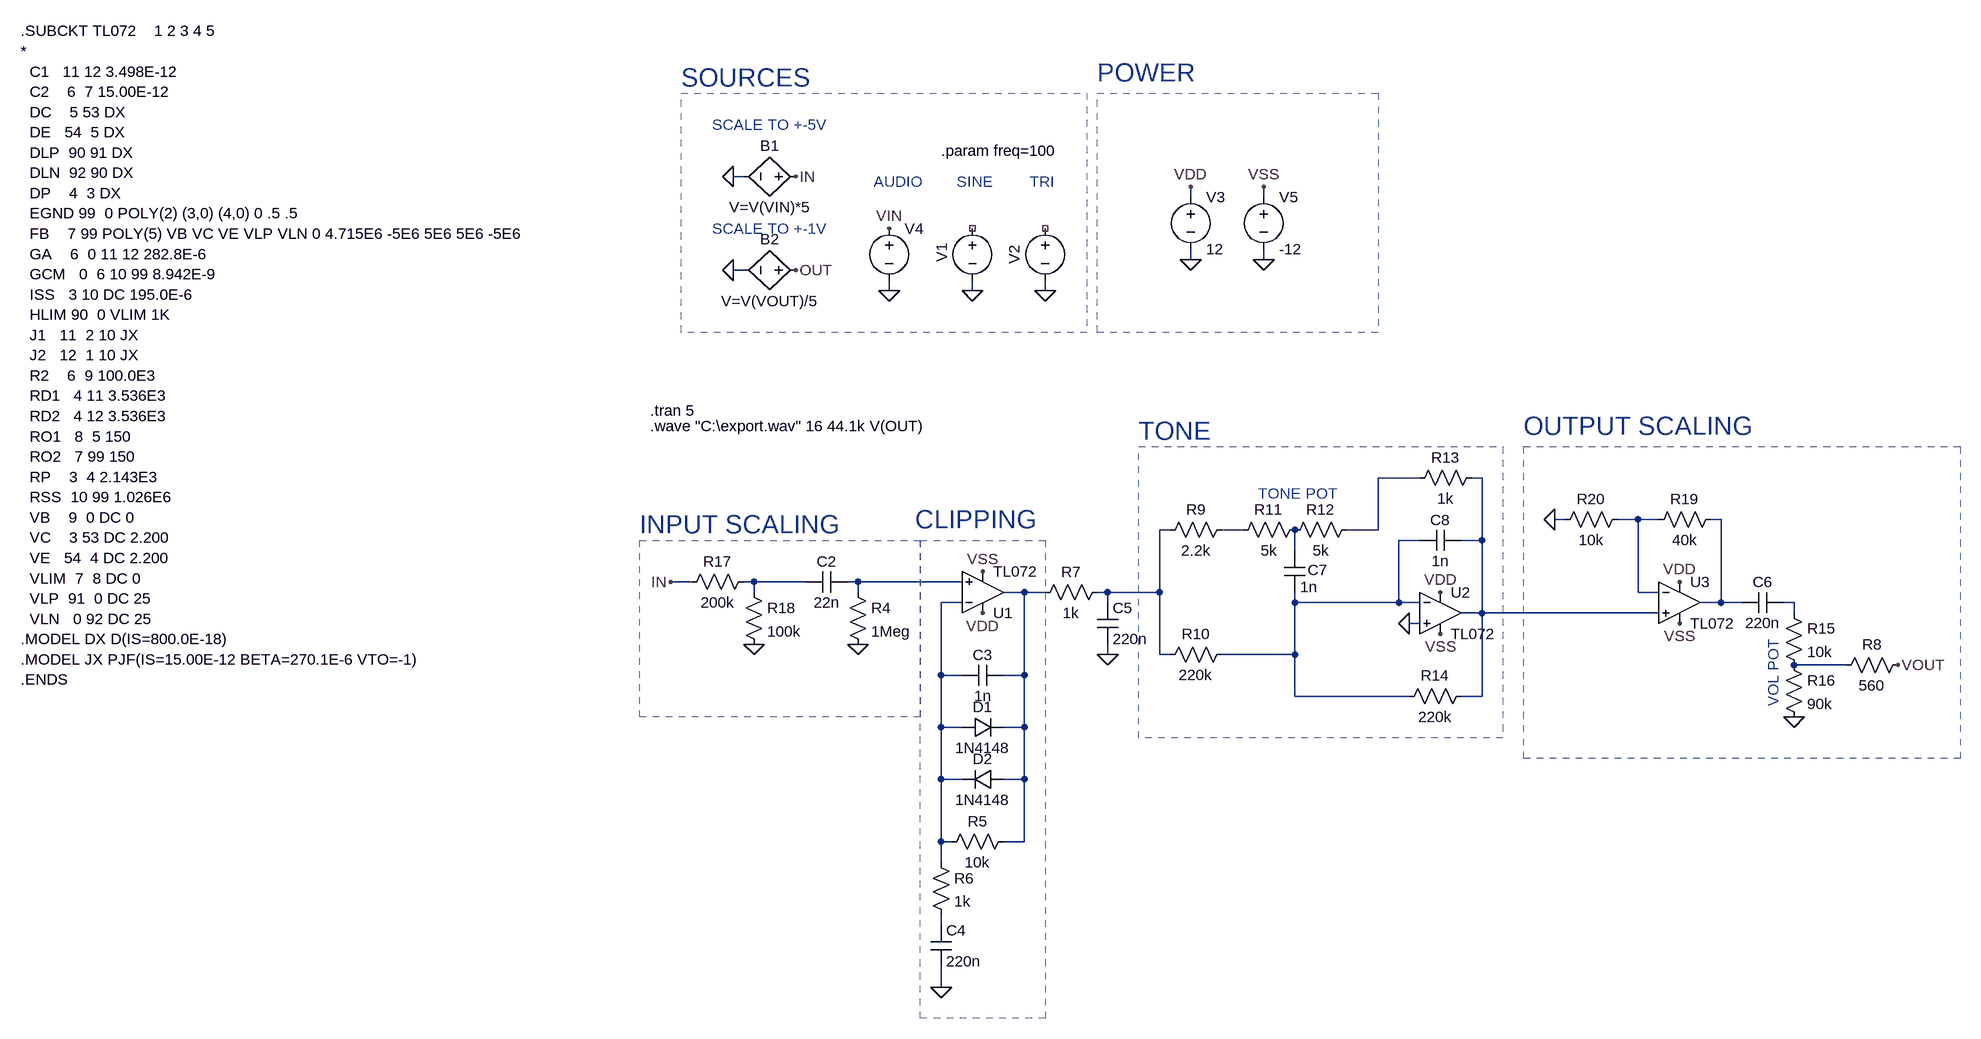
[diagram p0: schematic od.asc]
od.asc, the LTspice schematic file:
Version 4
SHEET 1 1620 1480
WIRE -576 32 -592 32
WIRE 112 64 112 48
WIRE 224 64 224 48
WIRE 112 160 112 144
WIRE 224 160 224 144
WIRE -576 176 -592 176
WIRE -352 208 -352 192
WIRE -224 208 -224 192
WIRE -112 208 -112 192
WIRE 464 496 400 496
WIRE 560 496 544 496
WIRE 688 560 672 560
WIRE 800 560 768 560
WIRE 832 560 800 560
WIRE 928 560 912 560
WIRE 80 576 64 576
WIRE 192 576 160 576
WIRE 400 576 400 496
WIRE 400 576 352 576
WIRE 464 592 432 592
WIRE 560 592 560 496
WIRE 560 592 528 592
WIRE 272 608 272 576
WIRE -656 656 -688 656
WIRE -560 656 -576 656
WIRE -480 656 -560 656
WIRE -400 656 -416 656
WIRE -240 656 -400 656
WIRE -560 672 -560 656
WIRE -400 672 -400 656
WIRE -144 672 -176 672
WIRE -112 672 -144 672
WIRE -16 672 -32 672
WIRE 64 672 64 576
WIRE 64 672 -16 672
WIRE 800 672 800 560
WIRE 832 672 800 672
WIRE -240 688 -272 688
WIRE -16 688 -16 672
WIRE 272 688 272 672
WIRE 432 688 432 592
WIRE 432 688 272 688
WIRE 464 688 432 688
WIRE 928 688 928 560
WIRE 928 688 896 688
WIRE 960 688 928 688
WIRE 1040 688 1024 688
WIRE 560 704 560 592
WIRE 560 704 528 704
WIRE 832 704 560 704
WIRE 1040 704 1040 688
WIRE 464 720 448 720
WIRE -16 768 -16 752
WIRE 64 768 64 672
WIRE 80 768 64 768
WIRE 272 768 272 688
WIRE 272 768 160 768
WIRE 1120 784 1040 784
WIRE -272 800 -272 688
WIRE -240 800 -272 800
WIRE -144 800 -144 672
WIRE -144 800 -176 800
WIRE 272 832 272 768
WIRE 448 832 272 832
WIRE 560 832 560 704
WIRE 560 832 528 832
WIRE -272 880 -272 800
WIRE -240 880 -272 880
WIRE -144 880 -144 800
WIRE -144 880 -176 880
WIRE -272 960 -272 880
WIRE -240 960 -272 960
WIRE -144 960 -144 880
WIRE -144 960 -176 960
WIRE -272 1056 -272 960
WIRE -256 1056 -272 1056
WIRE -144 1056 -144 960
WIRE -144 1056 -176 1056
WIRE -272 1088 -272 1056
WIRE -272 1184 -272 1168
WIRE -272 1280 -272 1248
FLAG -352 112 VIN
FLAG -688 656 IN
FLAG -208 640 VSS
FLAG -208 704 VDD
FLAG 496 736 VSS
FLAG 496 672 VDD
FLAG 1200 784 VOUT
FLAG -496 32 IN
FLAG 864 656 VDD
FLAG 864 720 VSS
FLAG -496 176 OUT
FLAG 112 160 0
FLAG 224 160 0
FLAG 112 48 VDD
FLAG 224 48 VSS
FLAG -352 208 0
FLAG -592 176 0
FLAG -592 32 0
FLAG -560 752 0
FLAG -400 752 0
FLAG 448 720 0
FLAG 672 560 0
FLAG 1040 864 0
FLAG -272 1280 0
FLAG -16 768 0
FLAG -224 208 0
FLAG -112 208 0
SYMBOL voltage -112 96 R0
WINDOW 0 -32 56 VBottom 2
WINDOW 3 32 56 Invisible 2
WINDOW 123 0 0 Left 0
WINDOW 39 0 0 Left 0
SYMATTR InstName V2
SYMATTR Value PULSE(0 250m 0 {0.5/freq} {0.5/freq} 0 {1/freq})
SYMBOL voltage -224 96 R0
WINDOW 0 -47 39 VRight 2
WINDOW 3 24 96 Invisible 2
WINDOW 123 0 0 Left 0
WINDOW 39 0 0 Left 0
SYMATTR InstName V1
SYMATTR Value SINE(0 1 {freq})
SYMBOL voltage -352 96 R0
WINDOW 3 24 96 Invisible 2
SYMATTR Value wavefile="C:\input.wav" chan=0
SYMATTR InstName V4
SYMBOL cap -416 640 R90
WINDOW 0 0 32 VBottom 2
WINDOW 3 32 32 VTop 2
SYMATTR InstName C2
SYMATTR Value 22n
SYMBOL res -416 656 R0
SYMATTR InstName R4
SYMATTR Value 1Meg
SYMBOL OpAmps\\opamp2 -208 736 M180
SYMATTR InstName U1
SYMATTR Value TL072
SYMBOL cap -176 784 R90
WINDOW 0 0 32 VBottom 2
WINDOW 3 32 32 VTop 2
SYMATTR InstName C3
SYMATTR Value 1n
SYMBOL diode -240 896 R270
WINDOW 0 32 32 VTop 2
WINDOW 3 0 32 VBottom 2
SYMATTR InstName D1
SYMATTR Value 1N4148
SYMBOL diode -176 944 R90
WINDOW 0 0 32 VBottom 2
WINDOW 3 32 32 VTop 2
SYMATTR InstName D2
SYMATTR Value 1N4148
SYMBOL res -160 1040 R90
WINDOW 0 0 56 VBottom 2
WINDOW 3 32 56 VTop 2
SYMATTR InstName R5
SYMATTR Value 10k
SYMBOL res -288 1072 R0
SYMATTR InstName R6
SYMATTR Value 1k
SYMBOL cap -288 1184 R0
SYMATTR InstName C4
SYMATTR Value 220n
SYMBOL res -16 656 R90
WINDOW 0 0 56 VBottom 2
WINDOW 3 32 56 VTop 2
SYMATTR InstName R7
SYMATTR Value 1k
SYMBOL cap -32 688 R0
SYMATTR InstName C5
SYMATTR Value 220n
SYMBOL cap 1024 672 R90
WINDOW 0 0 32 VBottom 2
WINDOW 3 32 32 VTop 2
SYMATTR InstName C6
SYMATTR Value 220n
SYMBOL res 176 560 R90
WINDOW 0 0 56 VBottom 2
WINDOW 3 32 56 VTop 2
SYMATTR InstName R9
SYMATTR Value 2.2k
SYMBOL res 176 752 R90
WINDOW 0 0 56 VBottom 2
WINDOW 3 32 56 VTop 2
SYMATTR InstName R10
SYMATTR Value 220k
SYMBOL res 288 560 R90
WINDOW 0 0 56 VBottom 2
WINDOW 3 32 56 VTop 2
SYMATTR InstName R11
SYMATTR Value 5k
SYMBOL res 368 560 R90
WINDOW 0 0 56 VBottom 2
WINDOW 3 32 56 VTop 2
SYMATTR InstName R12
SYMATTR Value 5k
SYMBOL cap 256 608 R0
WINDOW 0 36 30 Left 2
SYMATTR InstName C7
SYMATTR Value 1n
SYMBOL OpAmps\\opamp2 496 640 R0
SYMATTR InstName U2
SYMATTR Value TL072
SYMBOL cap 528 576 R90
WINDOW 0 0 32 VBottom 2
WINDOW 3 32 32 VTop 2
SYMATTR InstName C8
SYMATTR Value 1n
SYMBOL res 560 480 R90
WINDOW 0 0 56 VBottom 2
WINDOW 3 32 56 VTop 2
SYMATTR InstName R13
SYMATTR Value 1k
SYMBOL res 544 816 R90
WINDOW 0 0 56 VBottom 2
WINDOW 3 32 56 VTop 2
SYMATTR InstName R14
SYMATTR Value 220k
SYMBOL res 1024 688 R0
SYMATTR InstName R15
SYMATTR Value 10k
SYMBOL res 1024 768 R0
SYMATTR InstName R16
SYMATTR Value 90k
SYMBOL res 1216 768 R90
WINDOW 0 0 56 VBottom 2
WINDOW 3 32 56 VTop 2
SYMATTR InstName R8
SYMATTR Value 560
SYMBOL bv -480 32 R90
WINDOW 0 -32 56 VBottom 2
WINDOW 3 32 56 VTop 2
SYMATTR InstName B1
SYMATTR Value V=V(VIN)*5
SYMBOL res -560 640 R90
WINDOW 0 0 56 VBottom 2
WINDOW 3 32 56 VTop 2
SYMATTR InstName R17
SYMATTR Value 200k
SYMBOL res -576 656 R0
SYMATTR InstName R18
SYMATTR Value 100k
SYMBOL OpAmps\\opamp2 864 624 R0
SYMATTR InstName U3
SYMATTR Value TL072
SYMBOL res 928 544 R90
WINDOW 0 0 56 VBottom 2
WINDOW 3 32 56 VTop 2
SYMATTR InstName R19
SYMATTR Value 40k
SYMBOL res 784 544 R90
WINDOW 0 0 56 VBottom 2
WINDOW 3 32 56 VTop 2
SYMATTR InstName R20
SYMATTR Value 10k
SYMBOL bv -480 176 R90
WINDOW 0 -32 56 VBottom 2
WINDOW 3 32 56 VTop 2
SYMATTR InstName B2
SYMATTR Value V=V(VOUT)/5
SYMBOL voltage 112 48 R0
WINDOW 123 0 0 Left 0
WINDOW 39 0 0 Left 0
SYMATTR InstName V3
SYMATTR Value 12
SYMBOL voltage 224 48 R0
WINDOW 123 0 0 Left 0
WINDOW 39 0 0 Left 0
SYMATTR InstName V5
SYMATTR Value -12
TEXT -720 392 Left 2 !.tran 5
TEXT -1688 -192 Left 2 !.SUBCKT TL072    1 2 3 4 5\n*\n  C1   11 12 3.498E-12\n  C2    6  7 15.00E-12\n  DC    5 53 DX\n  DE   54  5 DX\n  DLP  90 91 DX\n  DLN  92 90 DX\n  DP    4  3 DX\n  EGND 99  0 POLY(2) (3,0) (4,0) 0 .5 .5\n  FB    7 99 POLY(5) VB VC VE VLP VLN 0 4.715E6 -5E6 5E6 5E6 -5E6\n  GA    6  0 11 12 282.8E-6\n  GCM   0  6 10 99 8.942E-9\n  ISS   3 10 DC 195.0E-6\n  HLIM 90  0 VLIM 1K\n  J1   11  2 10 JX\n  J2   12  1 10 JX\n  R2    6  9 100.0E3\n  RD1   4 11 3.536E3\n  RD2   4 12 3.536E3\n  RO1   8  5 150\n  RO2   7 99 150\n  RP    3  4 2.143E3\n  RSS  10 99 1.026E6\n  VB    9  0 DC 0\n  VC    3 53 DC 2.200\n  VE   54  4 DC 2.200\n  VLIM  7  8 DC 0\n  VLP  91  0 DC 25\n  VLN   0 92 DC 25\n.MODEL DX D(IS=800.0E-18)\n.MODEL JX PJF(IS=15.00E-12 BETA=270.1E-6 VTO=-1)\n.ENDS
TEXT -272 -8 Left 2 !.param freq=100
TEXT -720 416 Left 2 !.wave "C:\\export.wav" 16 44.1k V(OUT)
TEXT -248 40 Left 2 ;SINE
TEXT -136 40 Left 2 ;TRI
TEXT -376 40 Left 2 ;AUDIO
TEXT -672 -120 Left 4 ;SOURCES
TEXT -32 -128 Left 4 ;POWER
TEXT 216 520 Left 2 ;TONE POT
TEXT 1008 744 VRight 2 ;VOL POT
TEXT -624 -48 Left 2 ;SCALE TO +-5V
TEXT -624 112 Left 2 ;SCALE TO +-1V
TEXT -736 568 Left 4 ;INPUT SCALING
TEXT -312 560 Left 4 ;CLIPPING
TEXT 32 424 Left 4 ;TONE
TEXT 624 416 Left 4 ;OUTPUT SCALING
RECTANGLE Normal -304 864 -736 592 1
RECTANGLE Normal -112 1328 -304 592 1
RECTANGLE Normal 592 896 32 448 1
RECTANGLE Normal 1296 928 624 448 1
RECTANGLE Normal 400 272 -32 -96 1
RECTANGLE Normal -48 272 -672 -96 1

The netlist it stands for:
* od.asc
V2 NC_01 0 PULSE(0 250m 0 {0.5/freq} {0.5/freq} 0 {1/freq})
V1 NC_02 0 SINE(0 1 {freq})
V4 VIN 0 wavefile="C:\input.wav" chan=0
C2 N010 N009 22n
R4 N010 0 1Meg
XU1 N010 N012 VDD VSS N011 TL072  ; pins In+ In- V+ V- OUT
C3 N011 N012 1n
D1 N012 N011 1N4148
D2 N011 N012 1N4148
R5 N011 N012 10k
R6 N012 N015 1k
C4 N015 0 220n
R7 N005 N011 1k
C5 N005 0 220n
C6 N013 N004 220n
R9 N006 N005 2.2k
R10 N007 N005 220k
R11 N008 N006 5k
R12 N001 N008 5k
C7 N008 N007 1n
XU2 0 N007 VDD VSS N002 TL072  ; pins In+ In- V+ V- OUT
C8 N002 N007 1n
R13 N002 N001 1k
R14 N002 N007 220k
R15 N013 N014 10k
R16 N014 0 90k
R8 VOUT N014 560
B1 IN 0 V=V(VIN)*5
R17 N009 IN 200k
R18 N009 0 100k
XU3 N002 N003 VDD VSS N004 TL072  ; pins In+ In- V+ V- OUT
R19 N004 N003 40k
R20 N003 0 10k
B2 OUT 0 V=V(VOUT)/5
V3 VDD 0 12
V5 VSS 0 -12
.model D D
.lib standard.dio
.tran 5
.SUBCKT TL072    1 2 3 4 5
*
  C1   11 12 3.498E-12
  C2    6  7 15.00E-12
  DC    5 53 DX
  DE   54  5 DX
  DLP  90 91 DX
  DLN  92 90 DX
  DP    4  3 DX
  EGND 99  0 POLY(2) (3,0) (4,0) 0 .5 .5
  FB    7 99 POLY(5) VB VC VE VLP VLN 0 4.715E6 -5E6 5E6 5E6 -5E6
  GA    6  0 11 12 282.8E-6
  GCM   0  6 10 99 8.942E-9
  ISS   3 10 DC 195.0E-6
  HLIM 90  0 VLIM 1K
  J1   11  2 10 JX
  J2   12  1 10 JX
  R2    6  9 100.0E3
  RD1   4 11 3.536E3
  RD2   4 12 3.536E3
  RO1   8  5 150
  RO2   7 99 150
  RP    3  4 2.143E3
  RSS  10 99 1.026E6
  VB    9  0 DC 0
  VC    3 53 DC 2.200
  VE   54  4 DC 2.200
  VLIM  7  8 DC 0
  VLP  91  0 DC 25
  VLN   0 92 DC 25
.MODEL DX D(IS=800.0E-18)
.MODEL JX PJF(IS=15.00E-12 BETA=270.1E-6 VTO=-1)
.ENDS
.param freq=100
.wave "C:\export.wav" 16 44.1k V(OUT)
* SINE
* TRI
* AUDIO
* SOURCES
* POWER
* TONE POT
* VOL POT
* SCALE TO +-5V
* SCALE TO +-1V
* INPUT SCALING
* CLIPPING
* TONE
* OUTPUT SCALING
.backanno
.end